# EasyEDA schematic esp32_ EasyEDA file.json
TITLE: Sheet_1; REV: 1.0; Date: 2026-08-30; Sheet: 1/1; Drawn By: Kelvin Muia; Company: N/A
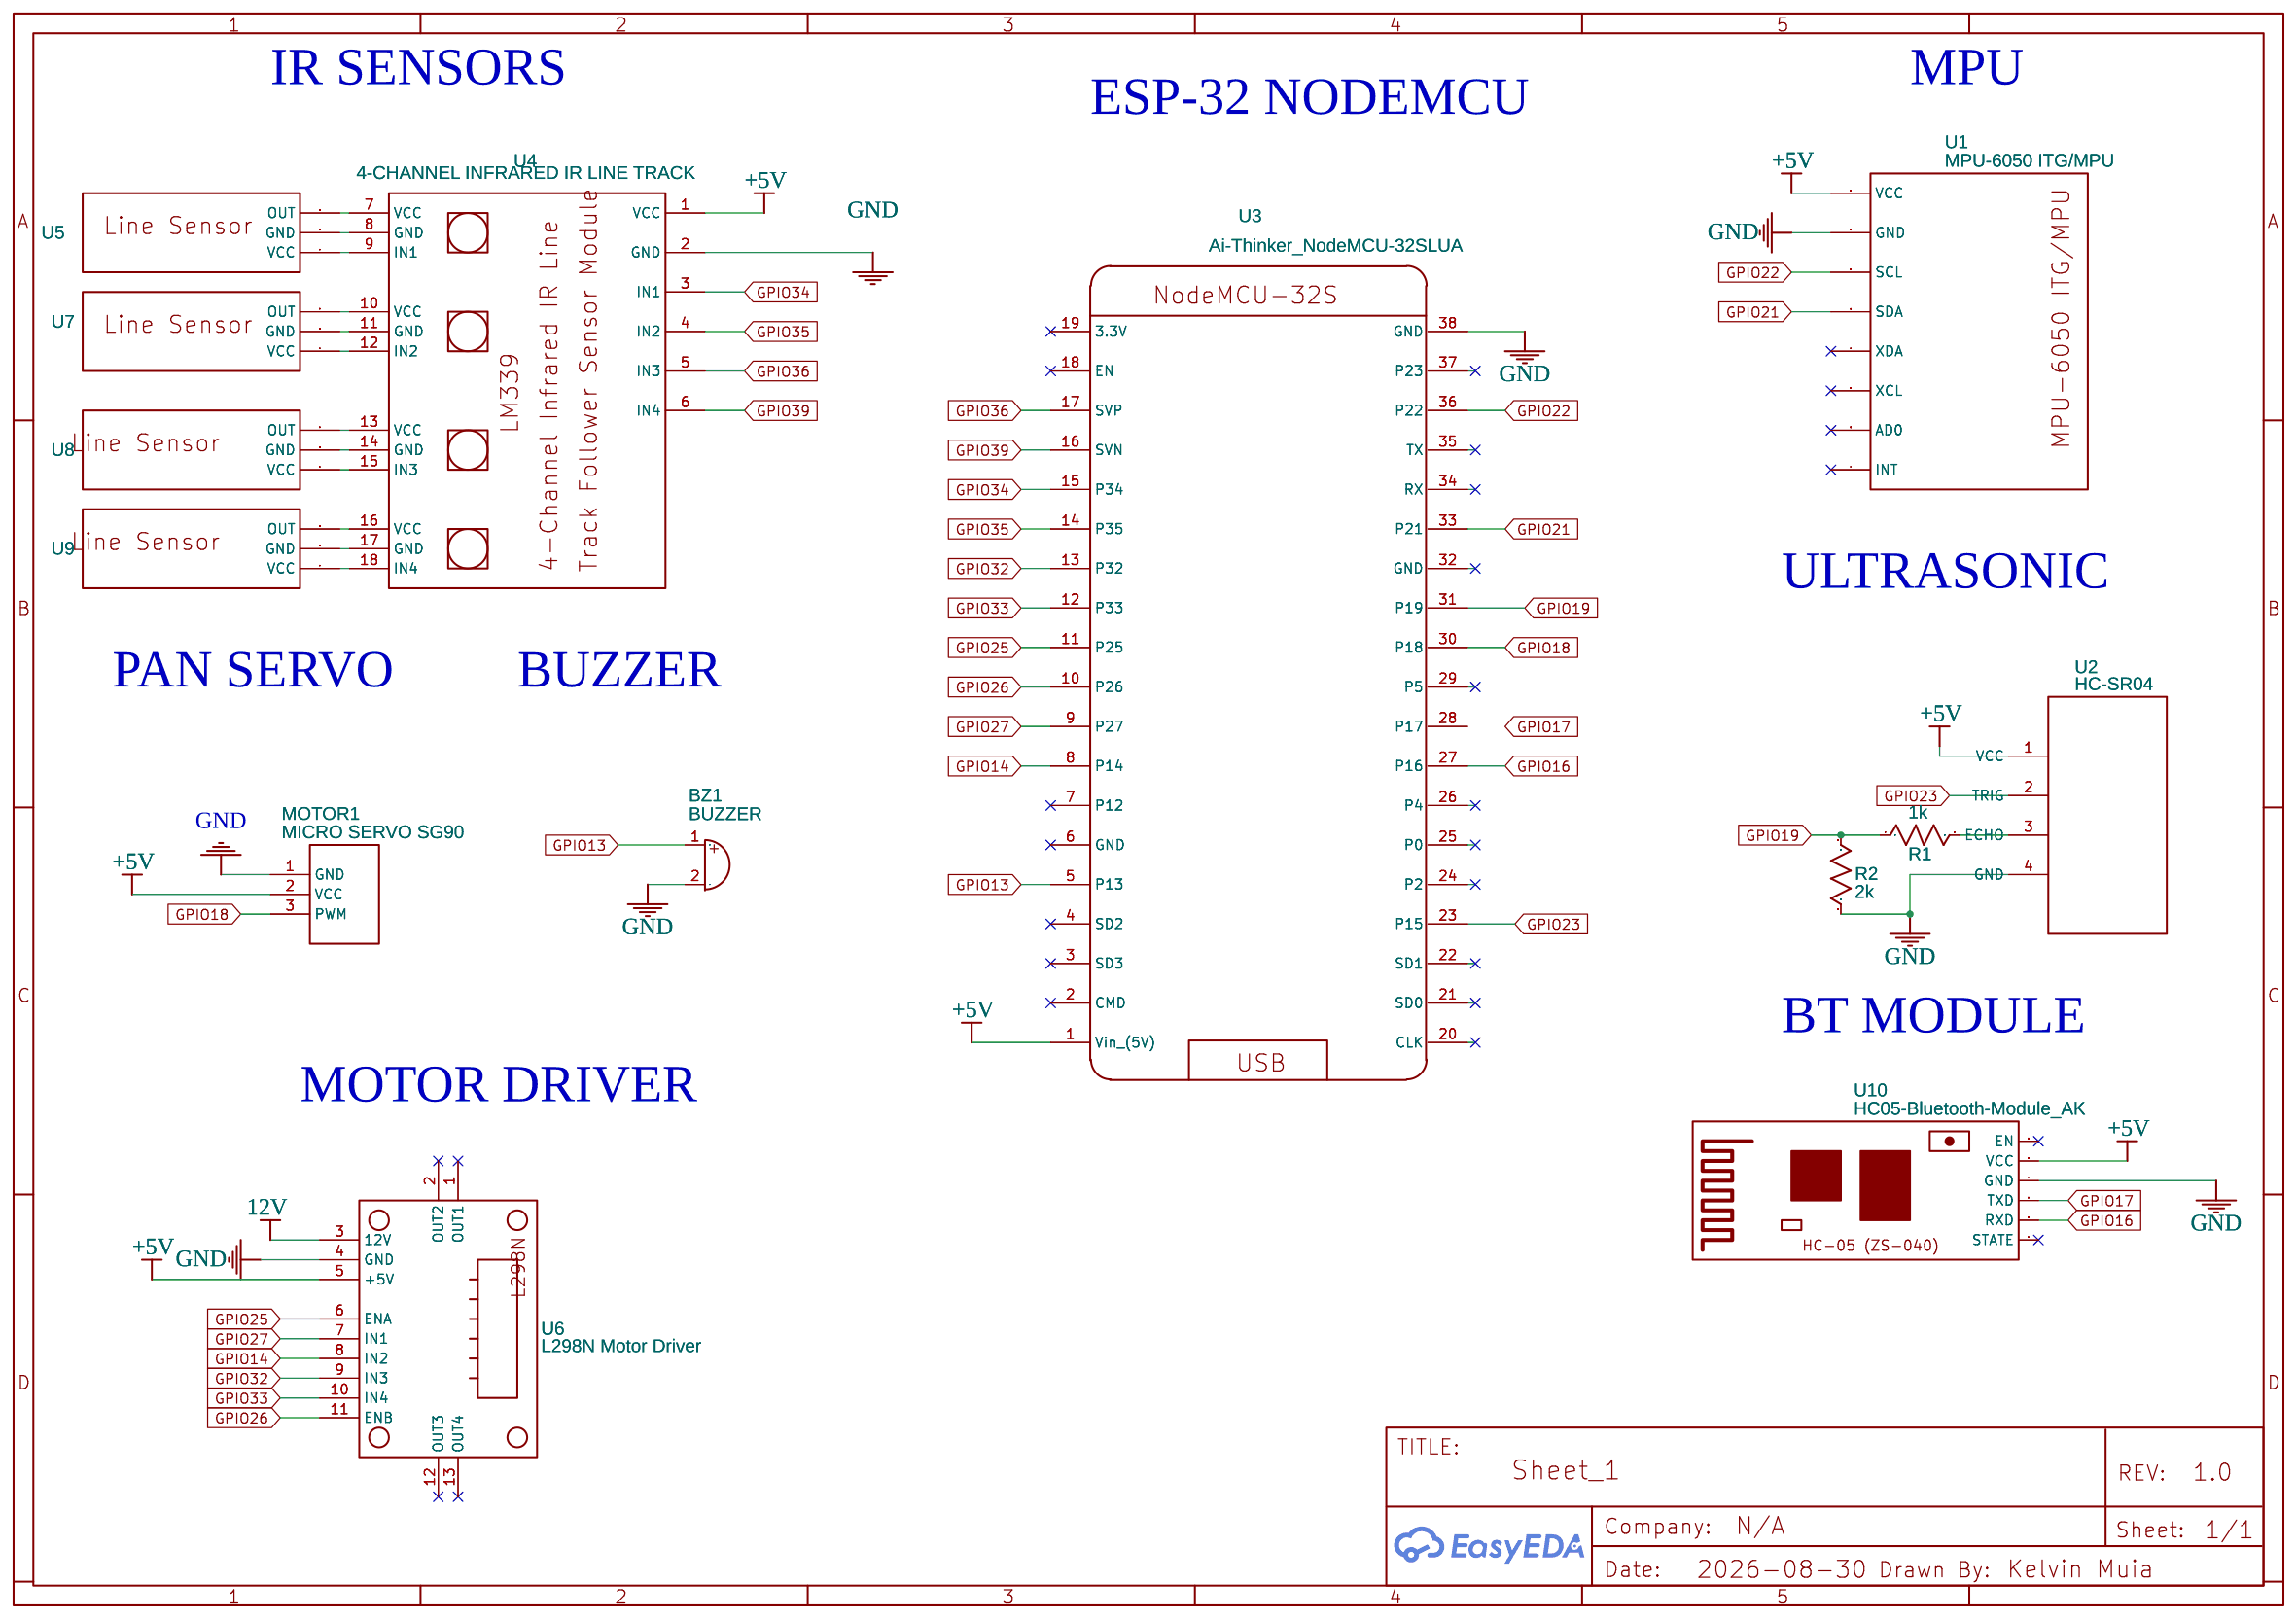
[diagram p0: schematic sheet]

## Parts
BZ1  BUZZER  [BUZZER_BEEPER:BUZZER_9X4MM]
MOTOR1  MICRO SERVO SG90  [MICRO SERVO SG90]
R1  1k  [R0603]
R2  2k  [R0603]
U1  MPU-6050 ITG/MPU  [MPU6050 ITG/MPU]
U2  HC-SR04  [HC_SR04]
U3  Ai-Thinker_NodeMCU-32SLUA  [AI-THINKER_NODEMCU-32SLUA]
U4  4-CHANNEL INFRARED IR LINE TRACK  [4-CHANNEL INFRARED IR LINE TRACK FOLLOWER SENSOR MODULE (LM339) COPY]
U5  MH-Sensor-Series Line Sensor  [MH-SENSOR-SERIES-LINE-SENSOR]
U6  L298N Motor Driver  [DRIVER L298N]
U7  MH-Sensor-Series Line Sensor  [MH-SENSOR-SERIES-LINE-SENSOR]
U8  MH-Sensor-Series Line Sensor  [MH-SENSOR-SERIES-LINE-SENSOR]
U9  MH-Sensor-Series Line Sensor  [MH-SENSOR-SERIES-LINE-SENSOR]
U10  HC05-Bluetooth-Module_AK  [HC05-BLUETOOTH-MODULE_AK]

## Library data of the parts
BZ1 = Device_Buzzer: Add into BOM: yes; Convert to PCB: yes; Origin Footprint: Buzzer_Beeper:Buzzer_12x9.5RM7.6; Contributor: jonathanjsuarez
MOTOR1 = MICRO SERVO SG90: Contributor: hoanx.iqqtech
R1 R2 = R_0603_US: Contributor: LCEDA_Lib
U1 = MPU-6050 ITG/MPU: Supplier: Bangood; Contributor: manarvink
U2 = HC-SR04: Contributor: fernando_l5
U3 = Ai-Thinker_NodeMCU-32SLUA: Supplier: LCSC; Supplier Part: C111436; Manufacturer: Ai-Thinker; Manufacturer Part: NodeMCU-32SLua; Contributor: jobsonp checked by LCSC
U4 = 4-CHANNEL INFRARED IR LINE TRACK FOLLOWER SENSOR MODULE (LM339) COPY: Manufacturer Part: LM339; Contributor: FelixBTG
U5 U7-U9 = MH-Sensor-Series Line Sensor: Contributor: eantis.prod
U6 = L298N Motor Driver: Contributor: Arne Josephus Morales
U10 = HC05-Bluetooth-Module_AK: Contributor: andrej.kanovsky

## Nets
12V: U6.3(12V)
+5V: MOTOR1.2(VCC) U1.0(VCC) U3.1(Vin (5V)) U4.1(VCC) U6.5(+5V) U10.5(VCC)
GND: BZ1.2(-) MOTOR1.1(GND) R2.2 U1.1(GND) U3.38(GND) U4.2(GND) U6.4(GND) U10.4(GND)
GPIO13: BZ1.1(+) U3.5(P13)
GPIO14: U3.8(P14) U6.8(IN2)
GPIO16: U3.27(P16) U10.2(RXD)
GPIO17: U10.3(TXD)
GPIO18: MOTOR1.3(PWM) U3.30(P18)
GPIO19: R1.1 R2.1 U3.31(P19)
GPIO21: U1.3(SDA) U3.33(P21)
GPIO22: U1.2(SCL) U3.36(P22)
GPIO23: U3.23(P15)
GPIO25: U3.11(P25) U6.6(ENA)
GPIO26: U3.10(P26) U6.11(ENB)
GPIO27: U3.9(P27) U6.7(IN1)
GPIO32: U3.13(P32) U6.9(IN3)
GPIO33: U3.12(P33) U6.10(IN4)
GPIO34: U3.15(P34) U4.3(IN1)
GPIO35: U3.14(P35) U4.4(IN2)
GPIO36: U3.17(SVP) U4.5(IN3)
GPIO39: U3.16(SVN) U4.6(IN4)
Net-(U4-7): U4.7(VCC) U5.2(OUT)
Net-(U4-8): U4.8(GND) U5.3(GND)
Net-(U4-9): U4.9(IN1) U5.4(VCC)
Net-(U4-10): U4.10(VCC) U7.2(OUT)
Net-(U4-11): U4.11(GND) U7.3(GND)
Net-(U4-12): U4.12(IN2) U7.4(VCC)
Net-(U4-13): U4.13(VCC) U8.2(OUT)
Net-(U4-14): U4.14(GND) U8.3(GND)
Net-(U4-15): U4.15(IN3) U8.4(VCC)
Net-(U4-16): U4.16(VCC) U9.2(OUT)
Net-(U4-17): U4.17(GND) U9.3(GND)
Net-(U4-18): U4.18(IN4) U9.4(VCC)

Not connected (* = marked no-connect by the designer): R1 2; U1 4(XDA)* 5(XCL)* 6(AD0)* 7(INT)*; U2 1(VCC) 2(TRIG) 3(ECHO) 4(GND); U3 2(CMD)* 3(SD3)* 4(SD2)* 6(GND)* 7(P12)* 18(EN)* 19(3.3V)* 20(CLK) 21(SD0) 22(SD1) 24(P2) 25(P0) 26(P4) 28(P17) 29(P5) 32(GND) 34(RX) 35(TX) 37(P23); U6 1(OUT1)* 2(OUT2)* 12(OUT3)* 13(OUT4)*; U10 1(STATE)* 6(EN)*

## Notes on the sheet
- IR SENSORS
- MPU
- ESP-32 NODEMCU
- ULTRASONIC
- PAN SERVO
- BUZZER
- BT MODULE
- MOTOR DRIVER
